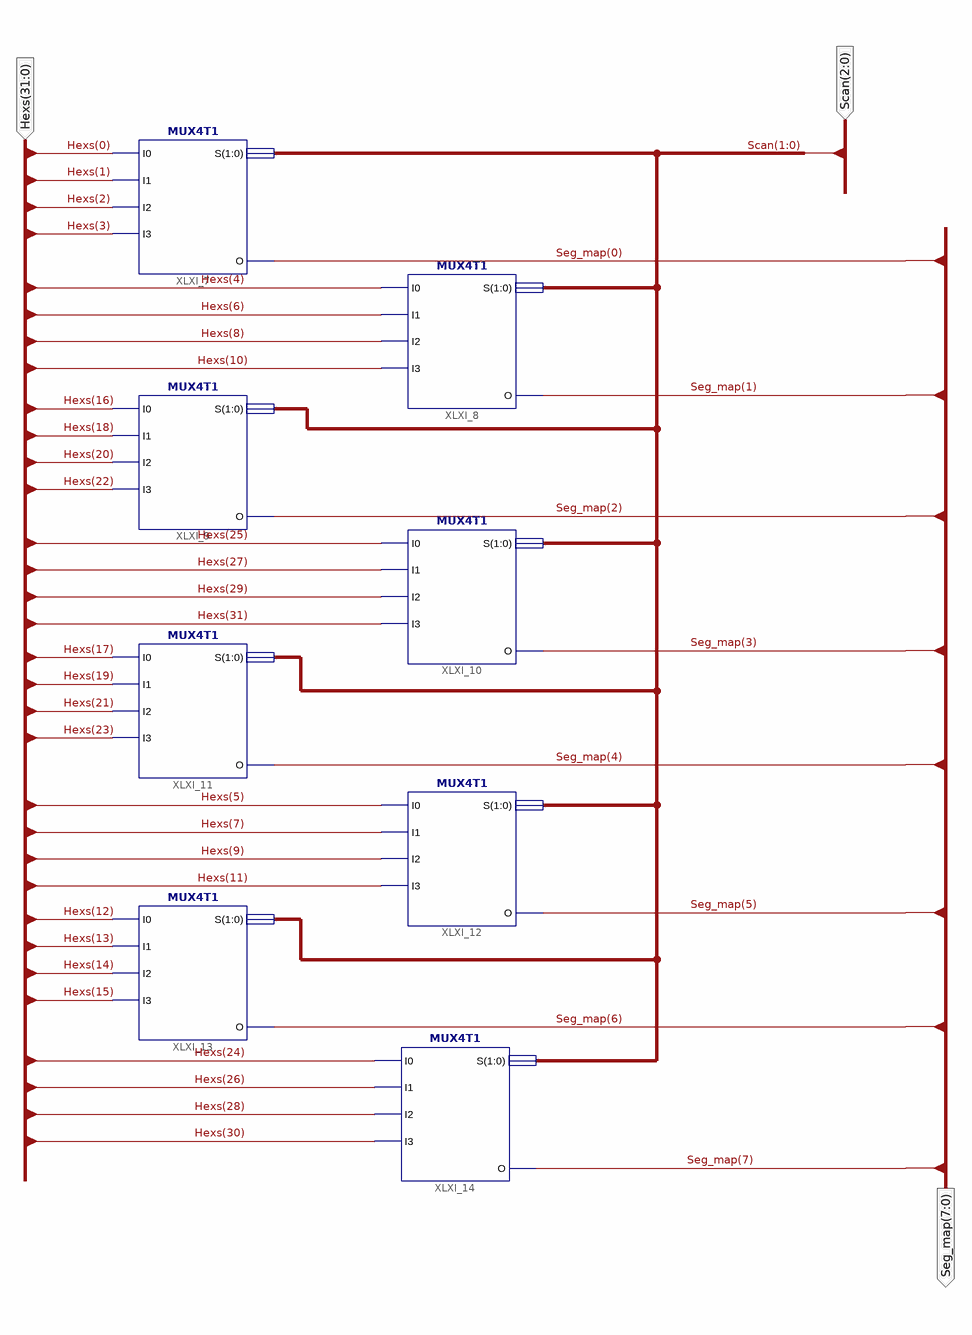
[diagram p0: schematic sheet 1]
// Xilinx ISE schematic Seg_map.sch (kintex7) as structural Verilog: 8 symbols, 3 ports
module Seg_map (
  input  [31:0] Hexs,
  input  [2:0] Scan,
  output [7:0] Seg_map
);

  MUX4T1 XLXI_7 (.S(Scan[1:0]), .I0(Hexs[0]), .I1(Hexs[1]), .I2(Hexs[2]), .I3(Hexs[3]), .O(Seg_map[0]));
  MUX4T1 XLXI_9 (.S(Scan[1:0]), .I0(Hexs[16]), .I1(Hexs[18]), .I2(Hexs[20]), .I3(Hexs[22]), .O(Seg_map[2]));
  MUX4T1 XLXI_10 (.S(Scan[1:0]), .I0(Hexs[25]), .I1(Hexs[27]), .I2(Hexs[29]), .I3(Hexs[31]), .O(Seg_map[3]));
  MUX4T1 XLXI_11 (.S(Scan[1:0]), .I0(Hexs[17]), .I1(Hexs[19]), .I2(Hexs[21]), .I3(Hexs[23]), .O(Seg_map[4]));
  MUX4T1 XLXI_12 (.S(Scan[1:0]), .I0(Hexs[5]), .I1(Hexs[7]), .I2(Hexs[9]), .I3(Hexs[11]), .O(Seg_map[5]));
  MUX4T1 XLXI_13 (.S(Scan[1:0]), .I0(Hexs[12]), .I1(Hexs[13]), .I2(Hexs[14]), .I3(Hexs[15]), .O(Seg_map[6]));
  MUX4T1 XLXI_14 (.S(Scan[1:0]), .I0(Hexs[24]), .I1(Hexs[26]), .I2(Hexs[28]), .I3(Hexs[30]), .O(Seg_map[7]));
  MUX4T1 XLXI_8 (.S(Scan[1:0]), .I0(Hexs[4]), .I1(Hexs[6]), .I2(Hexs[8]), .I3(Hexs[10]), .O(Seg_map[1]));
endmodule
